# Altium schematic sheet LIDO-HW.400.AccessoryInterfaces.SchDoc
size A3; SheetNumber: 17; SheetTotal: 17
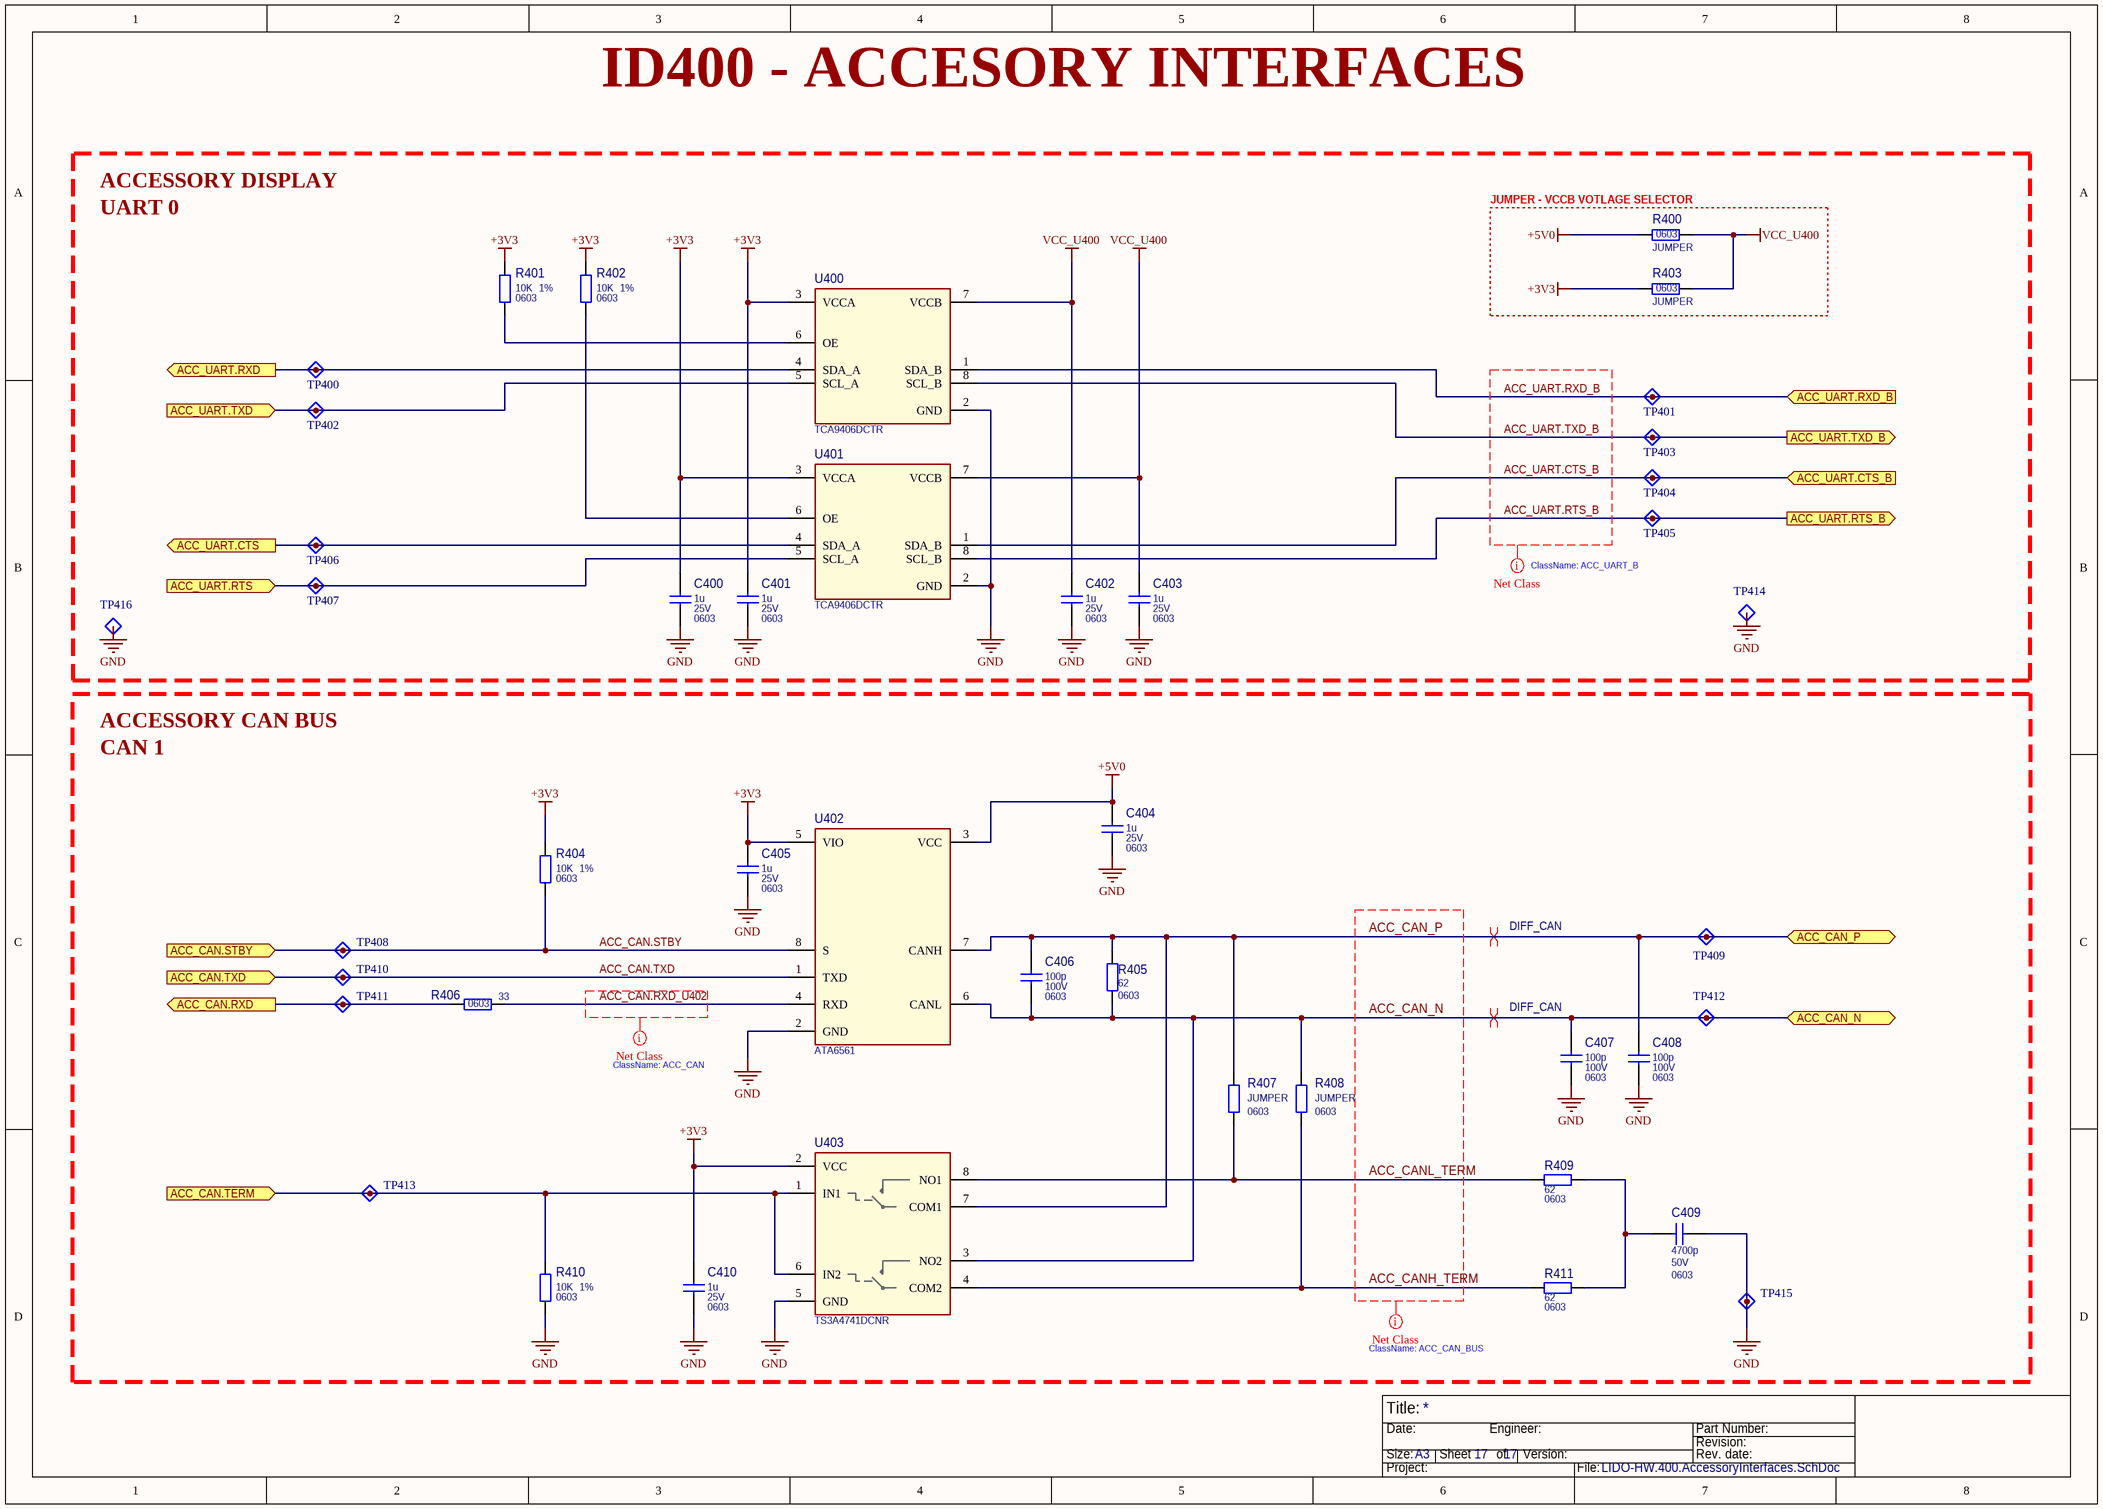
[diagram p0: LIDO-HW.400.AccessoryInterfaces.SchDoc]

## Parts
C400  1u  Part Value 2: 25V  Part Package: 0603  [CAP_0603_1608X90-N_MURATA_A]
C401  1u  Part Value 2: 25V  Part Package: 0603  [CAP_0603_1608X90-N_MURATA_A]
C402  1u  Part Value 2: 25V  Part Package: 0603  [CAP_0603_1608X90-N_MURATA_A]
C403  1u  Part Value 2: 25V  Part Package: 0603  [CAP_0603_1608X90-N_MURATA_A]
C404  1u  Part Value 2: 25V  Part Package: 0603  [CAP_0603_1608X90-N_MURATA_A]
C405  1u  Part Value 2: 25V  Part Package: 0603  [CAP_0603_1608X90-N_MURATA_A]
C406  100p  Part Value 2: 100V  Part Package: 0603  [CAP_0603_1608X90-N_MURATA_A]
C407  100p  Part Value 2: 100V  Part Package: 0603  [CAP_0603_1608X90-N_MURATA_A]
C408  100p  Part Value 2: 100V  Part Package: 0603  [CAP_0603_1608X90-N_MURATA_A]
C409  4700p  Part Value 2: 50V  Part Package: 0603  [CAP_0603_1608X90-N_MURATA_A]
C410  1u  Part Value 2: 25V  Part Package: 0603  [CAP_0603_1608X90-N_MURATA_A]
R400  JUMPER  Part Package: 0603  [RES_0603_1608X60-N_YAGEO_A]
R401  10K  Part Value 2: 1%  Part Package: 0603  [RES_0603_1608X60-N_YAGEO_A]
R402  10K  Part Value 2: 1%  Part Package: 0603  [RES_0603_1608X60-N_YAGEO_A]
R403  JUMPER  Part Package: 0603  [RES_0603_1608X60-N_YAGEO_A]
R404  10K  Part Value 2: 1%  Part Package: 0603  [RES_0603_1608X60-N_YAGEO_A]
R405  62  Part Package: 0603  [RES_0603_1608X60-N_YAGEO_A]
R406  33  Part Package: 0603  [RES_0603_1608X60-N_YAGEO_A]
R407  JUMPER  Part Package: 0603  [RES_0603_1608X60-N_YAGEO_A]
R408  JUMPER  Part Package: 0603  [RES_0603_1608X60-N_YAGEO_A]
R409  62  Part Package: 0603  [RES_0603_1608X60-N_YAGEO_A]
R410  10K  Part Value 2: 1%  Part Package: 0603  [RES_0603_1608X60-N_YAGEO_A]
R411  62  Part Package: 0603  [RES_0603_1608X60-N_YAGEO_A]
TP400  TestPoint_A  [TESTPOINT_1D_A]  (value not drawn)  (no BOM)
TP401  TestPoint_A  [TESTPOINT_1D_A]  (value not drawn)  (no BOM)
TP402  TestPoint_A  [TESTPOINT_1D_A]  (value not drawn)  (no BOM)
TP403  TestPoint_A  [TESTPOINT_1D_A]  (value not drawn)  (no BOM)
TP404  TestPoint_A  [TESTPOINT_1D_A]  (value not drawn)  (no BOM)
TP405  TestPoint_A  [TESTPOINT_1D_A]  (value not drawn)  (no BOM)
TP406  TestPoint_A  [TESTPOINT_1D_A]  (value not drawn)  (no BOM)
TP407  TestPoint_A  [TESTPOINT_1D_A]  (value not drawn)  (no BOM)
TP408  TestPoint_A  [TESTPOINT_1D_A]  (value not drawn)  (no BOM)
TP409  TestPoint_A  [TESTPOINT_1D_A]  (value not drawn)  (no BOM)
TP410  TestPoint_A  [TESTPOINT_1D_A]  (value not drawn)  (no BOM)
TP411  TestPoint_A  [TESTPOINT_1D_A]  (value not drawn)  (no BOM)
TP412  TestPoint_A  [TESTPOINT_1D_A]  (value not drawn)  (no BOM)
TP413  TestPoint_A  [TESTPOINT_1D_A]  (value not drawn)  (no BOM)
TP414  TestPoint_A  [TESTPOINT_1D_A]  (value not drawn)  (no BOM)
TP415  TestPoint_A  [TESTPOINT_1D_A]  (value not drawn)  (no BOM)
TP416  TestPoint_A  [TESTPOINT_1D_A]  (value not drawn)  (no BOM)
U400  TCA9406DCTR  [SSOP8P65_295X400X130L40X25-N_TI_A]
U401  TCA9406DCTR  [SSOP8P65_295X400X130L40X25-N_TI_A]
U402  ATA6561  [SOIC8P127_490X600X175L84X41-N_TI_A]
U403  TS3A4741DCNR  [SOT23-8P65_280X145L45-N_TI_A]

## Blocks framed on the sheet
JUMPER - VCCB VOTLAGE SELECTOR: R400 R403

## Ports
ACC_CAN.RXD (out), ACC_CAN.STBY (in), ACC_CAN.TERM (in), ACC_CAN.TXD (in), ACC_CAN_N (bidir), ACC_CAN_P (bidir), ACC_UART.CTS (out), ACC_UART.CTS_B (in), ACC_UART.RTS (in), ACC_UART.RTS_B (out), ACC_UART.RXD (out), ACC_UART.RXD_B (in), ACC_UART.TXD (in), ACC_UART.TXD_B (out)

## Nets
+3V3: C400.1 C401.1 C405.1 C410.1 R401.2 R402.2 R403.1 R404.2 U400.3(VCCA) U401.3(VCCA) U402.5(VIO) U403.2(VCC)
+5V0: C404.1 R400.1 U402.3(VCC)
GND: C400.2 C401.2 C402.2 C403.2 C404.2 C405.2 C407.2 C408.2 C409.2 C410.2 R410.1 TP414.1(TP) TP415.1(TP) TP416.1(TP) U400.2(GND) U401.2(GND) U402.2(GND) U403.5(GND)
VCC_U400: C402.1 C403.1 R400.2 R403.2 U400.7(VCCB) U401.7(VCCB)
ACC_CAN.RXD: R406.1 TP411.1(TP) ; port ACC_CAN.RXD
ACC_CAN.RXD_U402: R406.2 U402.4(RXD)
ACC_CAN.STBY: R404.1 TP408.1(TP) U402.8(S) ; port ACC_CAN.STBY
ACC_CAN.TERM: R410.2 TP413.1(TP) U403.1(IN1) U403.6(IN2) ; port ACC_CAN.TERM
ACC_CAN.TXD: TP410.1(TP) U402.1(TXD) ; port ACC_CAN.TXD
ACC_CAN_N: C406.2 C407.1 R405.1 R408.2 TP412.1(TP) U402.6(CANL) U403.3(NO2) ; port ACC_CAN_N
ACC_CAN_P: C406.1 C408.1 R405.2 R407.2 TP409.1(TP) U402.7(CANH) U403.7(COM1) ; port ACC_CAN_P
ACC_CANH_TERM: R408.1 R411.1 U403.4(COM2)
ACC_CANL_TERM: R407.1 R409.1 U403.8(NO1)
ACC_UART.CTS: TP406.1(TP) U401.4(SDA_A) ; port ACC_UART.CTS
ACC_UART.CTS_B: TP404.1(TP) U401.1(SDA_B) ; port ACC_UART.CTS_B
ACC_UART.RTS: TP407.1(TP) U401.5(SCL_A) ; port ACC_UART.RTS
ACC_UART.RTS_B: TP405.1(TP) U401.8(SCL_B) ; port ACC_UART.RTS_B
ACC_UART.RXD: TP400.1(TP) U400.4(SDA_A) ; port ACC_UART.RXD
ACC_UART.RXD_B: TP401.1(TP) U400.1(SDA_B) ; port ACC_UART.RXD_B
ACC_UART.TXD: TP402.1(TP) U400.5(SCL_A) ; port ACC_UART.TXD
ACC_UART.TXD_B: TP403.1(TP) U400.8(SCL_B) ; port ACC_UART.TXD_B
NetC409_1: C409.1 R409.2 R411.2
NetR401_1: R401.1 U400.6(OE)
NetR402_1: R402.1 U401.6(OE)

## Layout directives
net class ACC_CAN_BUS: ACC_CAN_N, ACC_CAN_P, ACC_CANH_TERM, ACC_CANL_TERM
differential pair; differential pair class DIFF_CAN: ACC_CAN_N, ACC_CAN_P
net class ACC_UART_B: ACC_UART.CTS_B, ACC_UART.RTS_B, ACC_UART.RXD_B, ACC_UART.TXD_B
net class ACC_CAN: ACC_CAN.RXD_U402

## Notes on the sheet
- ID400 - ACCESORY INTERFACES
- ACCESSORY DISPLAY
- UART 0
- (near TP405) ClassName: ACC_UART_B
- ACCESSORY CAN BUS
- CAN 1
- ClassName: ACC_CAN
- ClassName: ACC_CAN_BUS
- Title:
- Size:
- Date:
- A3
- Sheet       of
- Engineer:
- Version:
- Part Number:
- Revision:
- Rev. date:
- Project:
- File:

## Library data of the parts
C400-C405 C410 = 78: CAP CER 1UF 25V X7R 0603; Manufacturer Part Number: CGA3E1X7R1E105M080AE; Manufacturer: TDK Corporation; Obsolete Part: False; Component ID: 78; Part Value: 1u; Part Value 3: X7R; Package Type: SMT
C406-C408 = 75: CAP CER 100PF 100V C0G 0603; Manufacturer Part Number: CGA3E2C0G2A101J080AA; Manufacturer: TDK Corporation; Obsolete Part: False; Component ID: 75; Part Value: 100p; Part Value 3: 5%; Package Type: SMT
C409 = 85: CAP CER 4700PF 50V X7R 0603; Manufacturer Part Number: CGA3E2X7R1H472K080AA; Manufacturer: TDK Corporation; Obsolete Part: False; Component ID: 85; Part Value: 4700p; Part Value 3: X7R; Package Type: SMT
R400 R403 R407 R408 = 9: RES 0 OHM JUMPER 1/10W 0603; Manufacturer Part Number: RC0603JR-070RL; Manufacturer: YAGEO; Manufacturer Part Number 2nd: RMCF0603ZT0R00; Manufacturer 2nd: Stackpole Electronics Inc; Obsolete Part: False; Component ID: 9; Part Value: JUMPER; Part Value 2: 5%; Part Value 3: 1/10W; Package Type: SMT
R401 R402 R404 R410 = 115: RES 10K OHM 1% 1/10W 0603; Manufacturer Part Number: RC0603FR-0710KL; Manufacturer: YAGEO; Obsolete Part: False; Component ID: 115; Part Value: 10K; Part Value 3: 1/10W; Package Type: SMT
R405 R409 R411 = 116: RES SMD 62 OHM 1% 1/10W 0603; Manufacturer Part Number: ERJ-3EKF62R0V; Manufacturer: Panasonic Electronic Components; Obsolete Part: False; Component ID: 116; Part Value: 62; Part Value 2: 1%; Part Value 3: 1/10W; Package Type: SMT
R406 = 121: RES 33 OHM 5% 1/10W 0603; Manufacturer Part Number: RC0603JR-0733RL; Manufacturer: YAGEO; Obsolete Part: False; Component ID: 121; Part Value: 33; Part Value 2: 5%; Part Value 3: 1/10W; Package Type: SMT
TP400-TP416 = 3: Pad Diamater 1mm; Part: Test Point 1D A; Obsolete Part: False; 00_Name: TP_XXmm; Component ID: 3; 02_Layer: *; 01_Diameter: 1mm
U400 U401 = 6: Voltage Level Translator Bidirectional 1 Circuit 2 Channel 24Mbps SM8; Manufacturer: Texas Instruments; Part Package: MSOP-8; Obsolete Part: False; Component ID: 6; Manufacturer Part Number: TCA9406DCTR; Part Type: Level Translator; Part Value: TCA9406DCTR; Package Type: SMT
U402 = 4: IC TRANSCEIVER 1/1 8SO; Manufacturer: Microchip Technology; Manufacturer Part Number: ATA6561-GAQW; Part Package: SOIC-8; Obsolete Part: False; Designer: Matt Drazenovich; Ratings: RoHS; Reviewed: Dekimo_07-07-2020; Component ID: 4; Case/Package: 8-SOIC; ComponentType: IC; Design Date: 22-11-2019; Max Operating Temperature: 150°C; Min Operating Temperature: -40°C; Value: ATA6561; Part Type: TRANSCEIVER; Package Type: SMT
U403 = 5: IC SWITCH DUAL SPST SOT23-8; Manufacturer: Texas Instruments; Obsolete Part: False; Designer: Matt Drazenovich; Ratings: RoHS; Reviewed: Not Footprint; Component ID: 5; Case/Package: SOT-23-8; ComponentType: IC; Design Date: 09-09-2021; Manufacturer Part Number: TS3A4741DCNR; Max Operating Temperature: 85°C; Min Operating Temperature: -40°C; Value: TS3A4741DCNR; Part Type: ANALOG SWITCH; Part Package: SOT23-8; Package Type: SMT